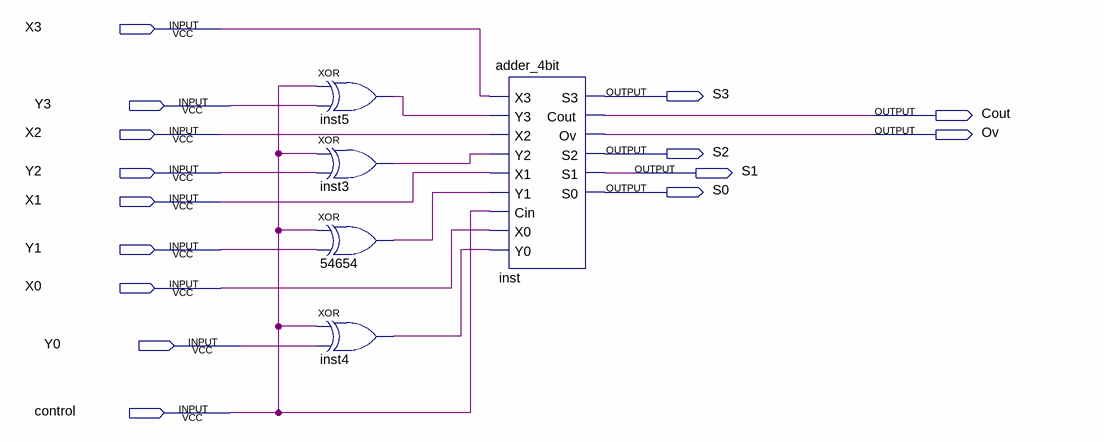
[diagram p0: schematic sheet]
// Quartus schematic addsub.bdf as structural Verilog: 5 symbols, 15 pins
module addsub (
  input  X3,
  input  Y3,
  input  X2,
  input  Y2,
  input  X1,
  input  Y1,
  input  X0,
  input  Y0,
  input  control,
  output S3,
  output Cout,
  output Ov,
  output S2,
  output S1,
  output S0
);

  wire inst3_out, inst4_out, inst5_out, n54654_out;

  xor inst5 (inst5_out, control, Y3);
  xor inst3 (inst3_out, control, Y2);
  xor u_54654 (n54654_out, control, Y1);
  xor inst4 (inst4_out, control, Y0);
  adder_4bit inst (
    .X3(X3), .Y3(inst5_out), .X2(X2), .Y2(inst3_out), .X1(X1), .Y1(n54654_out), .Cin(control), .X0(X0),
    .Y0(inst4_out), .S3(S3), .Cout(Cout), .Ov(Ov), .S2(S2), .S1(S1), .S0(S0));
endmodule
